# EAGLE design rc2014_romram (EAGLE 8.1.1)
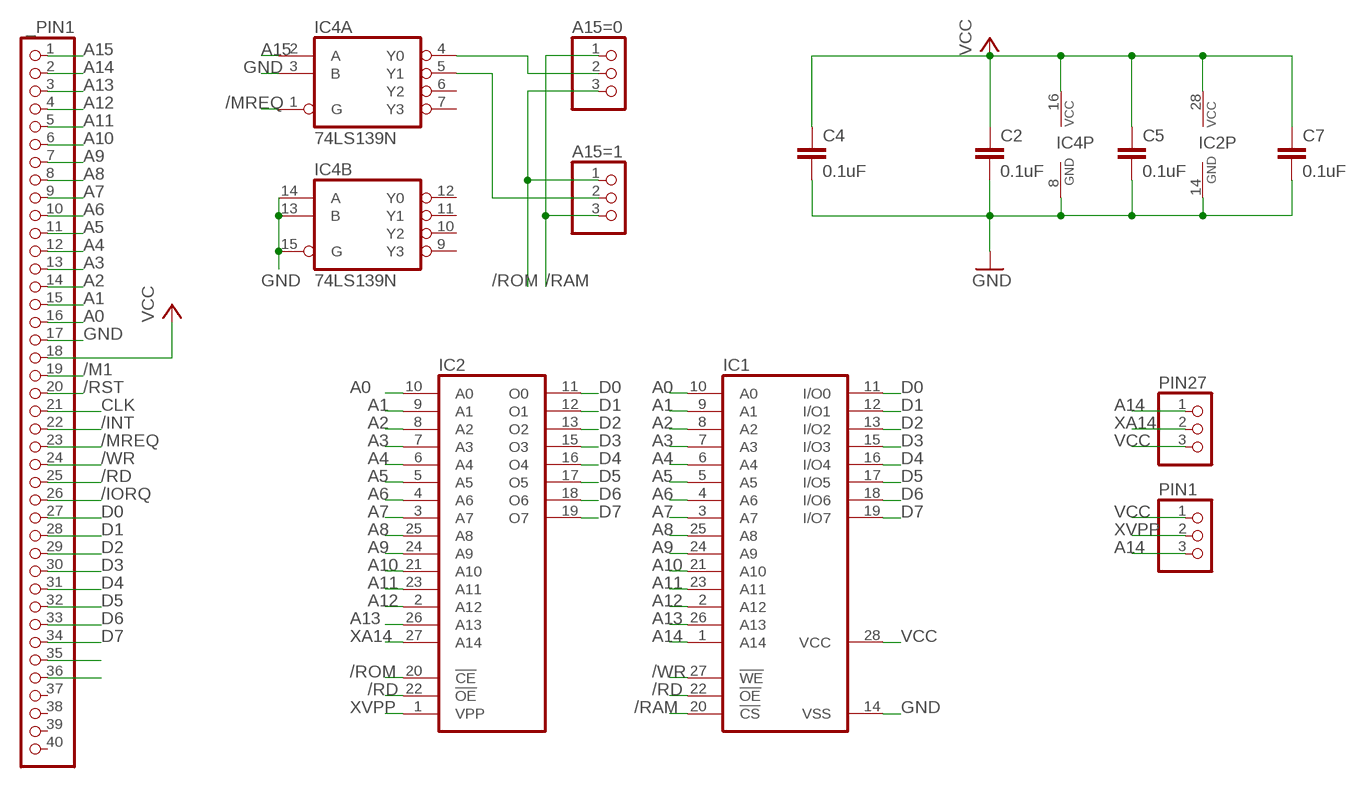
[diagram p0: schematic, sheet 1]

## Parts
_PIN1  PINHD-1X40  [1X40]
A15=0  PINHD-1X3  [1X03]
A15=1  PINHD-1X3  [1X03]
C2  0.1uF  C-EU050-024X044  [C050-024X044]
C4  0.1uF  C-EU050-024X044  [C050-024X044]
C5  0.1uF  C-EU050-024X044  [C050-024X044]
C7  0.1uF  C-EU050-024X044  [C050-024X044]
IC1  62256P  [DIL28-6]
IC2  27256  [DIL28]
IC4  74LS139N  [DIL16]
PIN1  PINHD-1X3  [1X03]
PIN27  PINHD-1X3  [1X03]

## Nets
/INT: _PIN1.22
/IORQ: _PIN1.26
/M1: _PIN1.19
/MREQ: _PIN1.23 IC4.1(A:G)
/RAM: A15=0.1 A15=1.3 IC1.20(!CS)
/RD: _PIN1.25 IC1.22(!OE) IC2.22(!OE)
/ROM: A15=0.3 A15=1.1 IC2.20(!CE)
/RST: _PIN1.20
/WR: _PIN1.24 IC1.27(!WE)
A0: _PIN1.16 IC1.10(A0) IC2.10(A0)
A1: _PIN1.15 IC1.9(A1) IC2.9(A1)
A2: _PIN1.14 IC1.8(A2) IC2.8(A2)
A3: _PIN1.13 IC1.7(A3) IC2.7(A3)
A4: _PIN1.12 IC1.6(A4) IC2.6(A4)
A5: _PIN1.11 IC1.5(A5) IC2.5(A5)
A6: _PIN1.10 IC1.4(A6) IC2.4(A6)
A7: _PIN1.9 IC1.3(A7) IC2.3(A7)
A8: _PIN1.8 IC1.25(A8) IC2.25(A8)
A9: _PIN1.7 IC1.24(A9) IC2.24(A9)
A10: _PIN1.6 IC1.21(A10) IC2.21(A10)
A11: _PIN1.5 IC1.23(A11) IC2.23(A11)
A12: _PIN1.4 IC1.2(A12) IC2.2(A12)
A13: _PIN1.3 IC1.26(A13) IC2.26(A13)
A14: _PIN1.2 IC1.1(A14) PIN1.3 PIN27.1
A15: _PIN1.1 IC4.2(A:A)
CLK: _PIN1.21
D0: _PIN1.27 IC1.11(I/O0) IC2.11(O0)
D1: _PIN1.28 IC1.12(I/O1) IC2.12(O1)
D2: _PIN1.29 IC1.13(I/O2) IC2.13(O2)
D3: _PIN1.30 IC1.15(I/O3) IC2.15(O3)
D4: _PIN1.31 IC1.16(I/O4) IC2.16(O4)
D5: _PIN1.32 IC1.17(I/O5) IC2.17(O5)
D6: _PIN1.33 IC1.18(I/O6) IC2.18(O6)
D7: _PIN1.34 IC1.19(I/O7) IC2.19(O7)
GND: _PIN1.17 C2.2 C4.2 C5.2 C7.2 IC1.14(VSS) IC2.14(GND) IC4.3(A:B) IC4.8(P:GND) IC4.13(B:B) IC4.14(B:A) IC4.15(B:G)
N$1: _PIN1.35
N$3: A15=0.2 IC4.4(A:Y0)
N$4: _PIN1.36
N$18: A15=1.2 IC4.5(A:Y1)
VCC: _PIN1.18 C2.1 C4.1 C5.1 C7.1 IC1.28(VCC) IC2.28(VCC) IC4.16(P:VCC) PIN1.1 PIN27.3
XA14: IC2.27(A14) PIN27.2
XVPP: IC2.1(VPP) PIN1.2
Unconnected: _PIN1.37 _PIN1.38 _PIN1.39 _PIN1.40 IC4.6(A:Y2) IC4.7(A:Y3) IC4.9(B:Y3) IC4.10(B:Y2) IC4.11(B:Y1) IC4.12(B:Y0)

## Library data of the parts
_PIN1 = pinhead:PINHD-1X40: PIN HEADER
A15=0 A15=1 PIN1 PIN27 = pinhead:PINHD-1X3: PIN HEADER
C2 C4 C5 C7 = rcl:C-EU: CAPACITOR, European symbol
IC1 = memory-hitachi:62256P: MEMORY; OC_FARNELL: unknown; OC_NEWARK: unknown
IC2 = memory:27256: MEMORY
IC4 = 74xx-eu:74*139: Dual 2-line to 4-line DECODER/DEMULTIPLEXER

## Net classes
0 +5V: width 0.508 mm

## Board
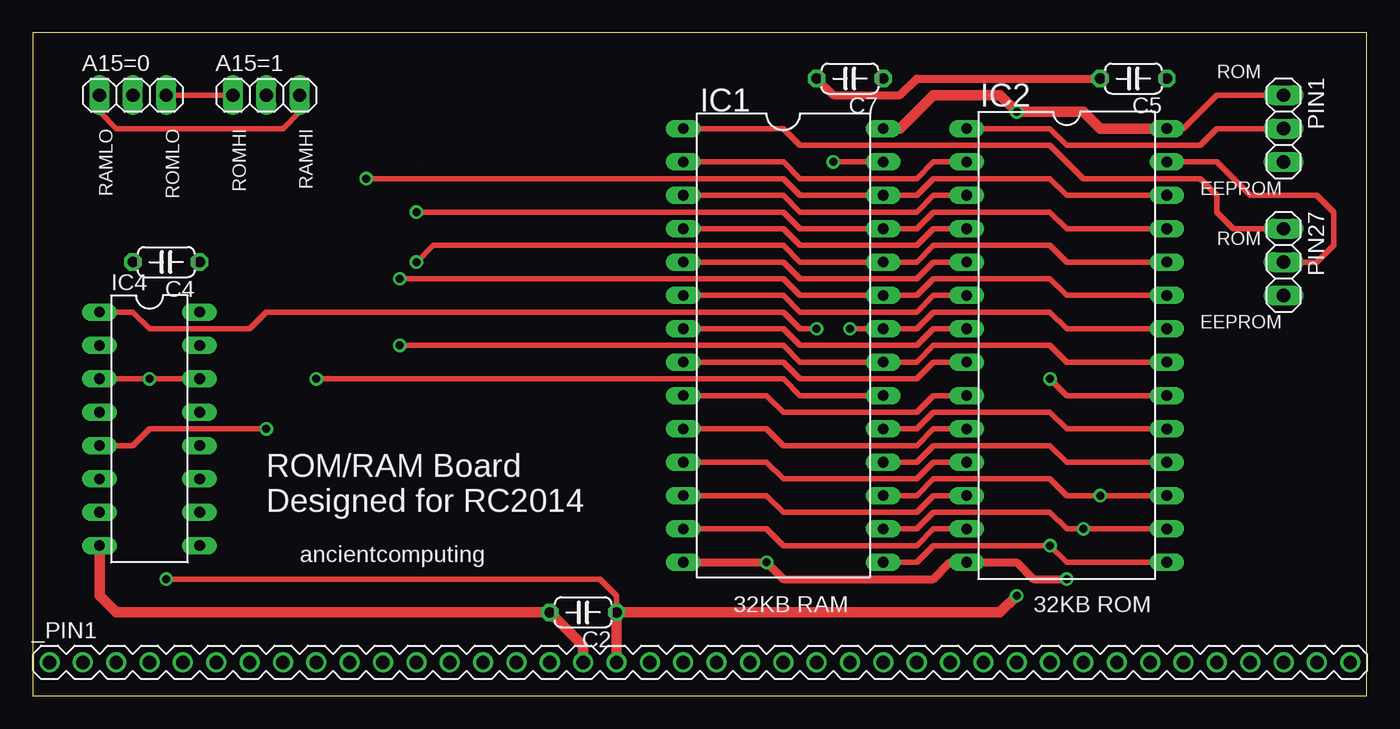
[diagram p1: board, top side]
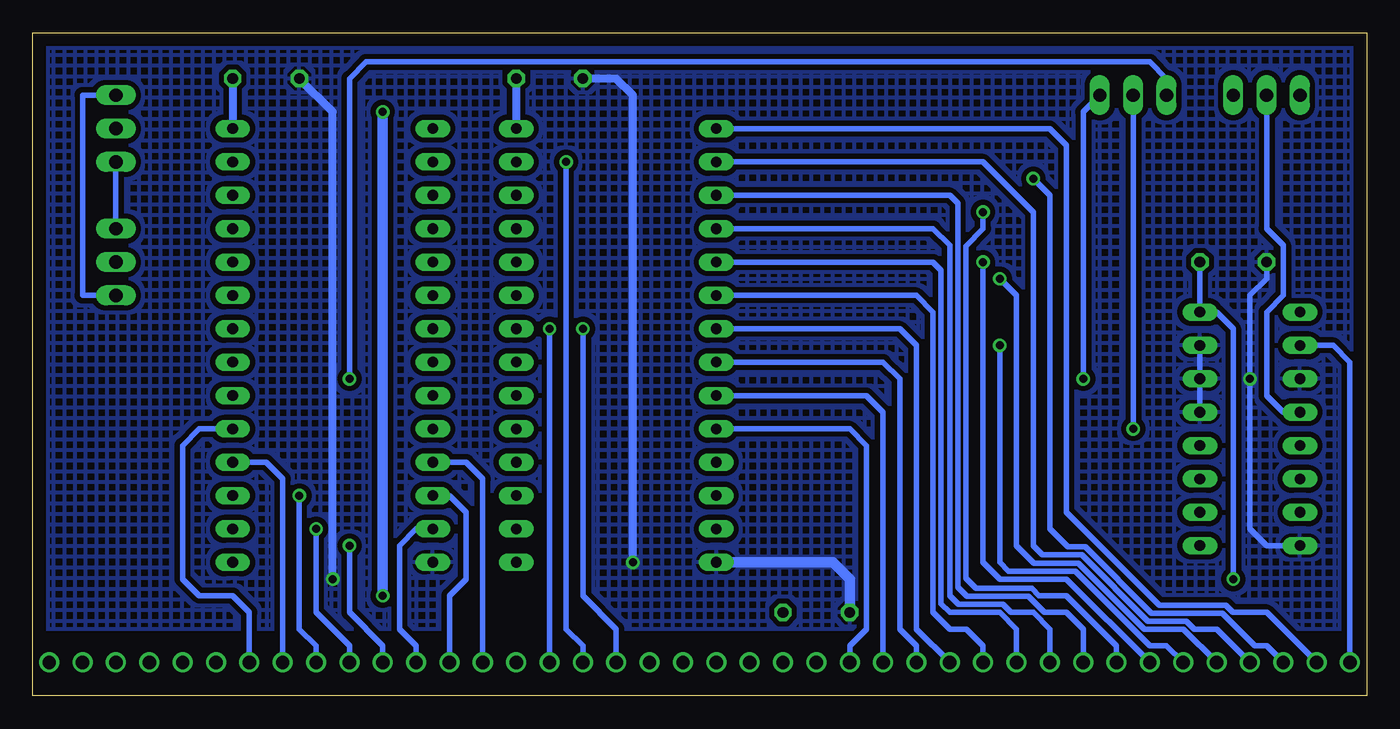
[diagram p2: board, bottom side, seen from below]

Size 101.58 x 50.47 mm. Coordinates in mm from the lower left corner, seen from the top.
Outline: 0,0 101.58,0 101.58,50.47 0,50.47 0,0
Copper layers (1*16): Top 0.035mm / dielectric 1.5mm / Bottom 0.035mm
Design rules "default": minimum track width 10mil, minimum drill 24mil, track to track 8mil, track to pad 8mil, pad to pad 8mil, via to via 8mil, smd to smd 8mil, copper to edge 40mil, drill to drill 8mil, minimum pad ring 10mil, minimum via ring 8mil, stop-mask expansion 4mil, vias tented up to drill 0mil, thermal gap 10mil

### Footprints (pad centres in the part's own frame; a part is rotated, then mirrored left to right if it is on the bottom)
1X40 = drill 1.016: 1 -49.53,0; 2 -46.99,0; 3 -44.45,0; 4 -41.91,0; 5 -39.37,0; 6 -36.83,0; 7 -34.29,0; 8 -31.75,0; 9 -29.21,0; 10 -26.67,0; 11 -24.13,0; 12 -21.59,0; 13 -19.05,0; 14 -16.51,0; 15 -13.97,0; 16 -11.43,0; 17 -8.89,0; 18 -6.35,0; 19 -3.81,0; 20 -1.27,0; 21 1.27,0; 22 3.81,0; 23 6.35,0; 24 8.89,0; 25 11.43,0; 26 13.97,0; 27 16.51,0; 28 19.05,0; 29 21.59,0; 30 24.13,0; 31 26.67,0; 32 29.21,0; 33 31.75,0; 34 34.29,0; 35 36.83,0; 36 39.37,0; 37 41.91,0; 38 44.45,0; 39 46.99,0; 40 49.53,0
1X03 = drill 1.016 long: 1 -2.54,0; 2 0,0; 3 2.54,0
C050-024X044 = drill 0.813 octagon: 1 -2.54,0; 2 2.54,0
DIL28-6 = drill 0.813 long: 1 -16.51,-7.62; 2 -13.97,-7.62; 3 -11.43,-7.62; 4 -8.89,-7.62; 5 -6.35,-7.62; 6 -3.81,-7.62; 7 -1.27,-7.62; 8 1.27,-7.62; 9 3.81,-7.62; 10 6.35,-7.62; 11 8.89,-7.62; 12 11.43,-7.62; 13 13.97,-7.62; 14 16.51,-7.62; 15 16.51,7.62; 16 13.97,7.62; 17 11.43,7.62; 18 8.89,7.62; 19 6.35,7.62; 20 3.81,7.62; 21 1.27,7.62; 22 -1.27,7.62; 23 -3.81,7.62; 24 -6.35,7.62; 25 -8.89,7.62; 26 -11.43,7.62; 27 -13.97,7.62; 28 -16.51,7.62
DIL28 = drill 0.813 long: 1 -16.51,-7.62; 2 -13.97,-7.62; 3 -11.43,-7.62; 4 -8.89,-7.62; 5 -6.35,-7.62; 6 -3.81,-7.62; 7 -1.27,-7.62; 8 1.27,-7.62; 9 3.81,-7.62; 10 6.35,-7.62; 11 8.89,-7.62; 12 11.43,-7.62; 13 13.97,-7.62; 14 16.51,-7.62; 15 16.51,7.62; 16 13.97,7.62; 17 11.43,7.62; 18 8.89,7.62; 19 6.35,7.62; 20 3.81,7.62; 21 1.27,7.62; 22 -1.27,7.62; 23 -3.81,7.62; 24 -6.35,7.62; 25 -8.89,7.62; 26 -11.43,7.62; 27 -13.97,7.62; 28 -16.51,7.62
DIL16 = drill 0.813 long: 1 -8.89,-3.81; 2 -6.35,-3.81; 3 -3.81,-3.81; 4 -1.27,-3.81; 5 1.27,-3.81; 6 3.81,-3.81; 7 6.35,-3.81; 8 8.89,-3.81; 9 8.89,3.81; 10 6.35,3.81; 11 3.81,3.81; 12 1.27,3.81; 13 -1.27,3.81; 14 -3.81,3.81; 15 -6.35,3.81; 16 -8.89,3.81

### Placement (x,y rotation side)
_PIN1  50.8,2.54 0 top
A15=0  7.62,45.72 0 top
A15=1  17.78,45.72 0 top
C2  41.91,6.35 180 top
C4  10.16,33.02 180 top
C5  83.82,46.99 180 top
C7  62.23,46.99 180 top
IC1  57.15,26.67 270 top
IC2  78.74,26.67 270 top
IC4  8.89,20.32 270 top
PIN1  95.25,43.18 270 top
PIN27  95.25,33.02 270 top

### Tracks (layer width: path | path; a pad name or v marks a point on that pad's centre or on a via)
/MREQ  (via drill 0.61)
  Top 0.406: IC4.1 7.62,29.21 8.89,27.94 16.51,27.94 17.78,29.21 57.15,29.21 58.42,27.94 v59.69,27.94
  Bottom 0.406: _PIN1.23 57.15,5.08 59.69,7.62 v59.69,27.94
/RAM  (via drill 0.61)
  Top 0.406: IC1.20 58.42,22.86 57.15,24.13 v21.59,24.13 | A15=0.1 5.08,44.45 6.35,43.18 19.05,43.18 20.32,44.45 A15=1.3
  Bottom 0.406: A15=1.3 21.59,44.45 v21.59,24.13
/RD  (via drill 0.61)
  Top 0.406: IC2.22 78.74,27.94 77.47,29.21 68.58,29.21 67.31,27.94 IC1.22 v62.23,27.94
  Bottom 0.406: v62.23,27.94 _PIN1.25
/ROM  (via drill 0.61)
  Top 0.406: A15=0.3 A15=1.1 | IC2.20 78.74,22.86 v77.47,24.13
  Bottom 0.406: v77.47,24.13 77.47,46.99 76.2,48.26 16.51,48.26 15.24,46.99 A15=1.1
/WR  (via drill 0.61)
  Top 0.406: IC1.27 v60.96,40.64
  Bottom 0.406: _PIN1.24 59.69,3.81 60.96,5.08 v60.96,40.64
A0
  Top 0.406: IC1.10 55.88,20.32 57.15,19.05 67.31,19.05 68.58,20.32 IC2.10
  Bottom 0.406: _PIN1.16 39.37,3.81 38.1,5.08 38.1,19.05 39.37,20.32 IC1.10
A1
  Top 0.406: IC1.9 55.88,22.86 57.15,21.59 67.31,21.59 68.58,22.86 IC2.9
  Bottom 0.406: _PIN1.15 36.83,21.59 38.1,22.86 IC1.9
A2
  Top 0.406: IC1.8 57.15,25.4 58.42,24.13 67.31,24.13 68.58,25.4 IC2.8
  Bottom 0.406: _PIN1.14 34.29,3.81 35.56,5.08 35.56,24.13 36.83,25.4 IC1.8
A3
  Top 0.406: IC1.7 57.15,27.94 58.42,26.67 67.31,26.67 68.58,27.94 IC2.7
  Bottom 0.406: _PIN1.13 34.29,5.08 34.29,26.67 35.56,27.94 IC1.7
A4
  Top 0.406: IC1.6 57.15,30.48 58.42,29.21 67.31,29.21 68.58,30.48 IC2.6
  Bottom 0.406: _PIN1.12 29.21,3.81 30.48,5.08 31.75,5.08 33.02,6.35 33.02,29.21 34.29,30.48 IC1.6
A5
  Top 0.406: IC1.5 57.15,33.02 58.42,31.75 67.31,31.75 68.58,33.02 IC2.5
  Bottom 0.406: _PIN1.11 26.67,5.08 27.94,6.35 31.75,6.35 32.41,7.01 32.41,32.41 33.02,33.02 IC1.5
A6
  Top 0.406: IC1.4 57.15,35.56 58.42,34.29 67.31,34.29 68.58,35.56 IC2.4
  Bottom 0.406: _PIN1.10 24.13,5.08 25.4,6.35 27.08,6.35 27.69,6.96 31.09,6.96 31.75,7.62 31.75,34.29 33.02,35.56 IC1.4
A7
  Top 0.406: IC1.3 57.15,38.1 58.42,36.83 67.31,36.83 68.58,38.1 IC2.3
  Bottom 0.406: _PIN1.9 21.59,5.08 22.86,6.35 24.54,6.35 25.76,7.57 30.43,7.57 31.14,8.28 31.14,37.49 31.75,38.1 IC1.3
A8  (via drill 0.61)
  Top 0.406: IC2.25 78.74,35.56 77.47,36.83 68.58,36.83 67.31,35.56 IC1.25 58.42,35.56 57.15,36.83 v29.21,36.83
  Bottom 0.406: _PIN1.8 19.05,3.81 22.86,7.62 24.95,7.62 25.5,8.18 29.77,8.18 30.53,8.94 30.53,34.24 29.21,35.56 v29.21,36.83
A9  (via drill 0.61)
  Top 0.406: IC2.24 78.74,33.02 77.47,34.29 68.58,34.29 67.31,33.02 IC1.24 58.42,33.02 57.15,34.29 30.48,34.29 v29.21,33.02
  Bottom 0.406: _PIN1.7 22.86,8.89 27.94,8.89 29.21,10.16 v29.21,33.02
A10  (via drill 0.61)
  Top 0.406: IC2.21 78.74,25.4 77.47,26.67 68.58,26.67 67.31,25.4 IC1.21 58.42,25.4 57.15,26.67 v27.94,26.67
  Bottom 0.406: v27.94,26.67 27.94,10.16 27.28,9.5 22.2,9.5 16.51,3.81 15.24,3.81 _PIN1.6
A11  (via drill 0.61)
  Top 0.406: IC2.23 78.74,30.48 77.47,31.75 68.58,31.75 67.31,30.48 IC1.23 58.42,30.48 57.15,31.75 v27.94,31.75
  Bottom 0.406: _PIN1.5 13.97,5.08 16.92,5.08 21.95,10.11 25.35,10.11 26.67,11.43 26.67,30.48 v27.94,31.75
A12  (1 unrouted)
  Top 0.406: IC1.2 57.15,40.64 58.42,39.37 67.31,39.37 68.58,40.64 IC2.2
  Bottom 0.406: _PIN1.4 11.43,5.08 13.11,5.08 13.72,5.69 16.66,5.69 21.7,10.72 24.69,10.72 25.4,11.43 25.4,36.83 29.21,40.64 IC1.2
A13  (via drill 0.61)
  Top 0.406: IC2.26 78.74,38.1 77.47,39.37 68.58,39.37 67.31,38.1 IC1.26 58.42,38.1 57.15,39.37 v25.4,39.37
  Bottom 0.406: _PIN1.3 7.62,3.81 8.51,3.81 11,6.3 16.41,6.3 21.44,11.33 22.76,11.33 24.13,12.7 24.13,38.1 v25.4,39.37
A14
  Top 0.406: IC1.1 57.15,43.18 58.42,41.91 77.47,41.91 80.01,39.37 88.9,39.37 90.17,38.1 90.17,36.83 91.44,35.56 PIN27.1
  Bottom 0.406: _PIN1.2 7.62,6.35 10.19,6.35 10.74,6.91 15.8,6.91 22.86,13.97 22.86,41.91 24.13,43.18 IC1.1 | PIN1.3 PIN27.1
A15
  Bottom 0.406: _PIN1.1 1.27,25.4 2.54,26.67 IC4.2
D0
  Top 0.406: IC1.11 55.88,17.78 57.15,16.51 67.31,16.51 68.58,17.78 IC2.11
  Bottom 0.406: _PIN1.27 67.31,16.51 68.58,17.78 IC2.11
D1
  Top 0.406: IC1.12 55.88,15.24 57.15,13.97 67.31,13.97 68.58,15.24 IC2.12
  Bottom 0.406: _PIN1.28 69.85,7.62 68.58,8.89 68.58,13.97 69.85,15.24 IC2.12
D2
  Top 0.406: IC1.13 55.88,12.7 57.15,11.43 67.31,11.43 68.58,12.7 IC2.13
  Bottom 0.406: _PIN1.29 72.39,3.81 73.66,5.08 73.66,11.43 72.39,12.7 IC2.13
D3  (via drill 0.61)
  Top 0.406: IC1.15 67.31,10.16 68.58,11.43 v77.47,11.43 78.74,10.16 IC2.15
  Bottom 0.406: _PIN1.30 74.93,3.81 77.47,6.35 v77.47,11.43
D4  (via drill 0.61)
  Top 0.406: IC1.16 67.31,12.7 68.58,13.97 77.47,13.97 78.74,12.7 v80.01,12.7 IC2.16
  Bottom 0.406: _PIN1.31 77.47,3.81 80.01,6.35 v80.01,12.7
D5  (via drill 0.61)
  Top 0.406: IC1.17 67.31,15.24 68.58,16.51 77.47,16.51 78.74,15.24 v81.28,15.24 IC2.17
  Bottom 0.406: _PIN1.32 80.01,3.81 81.28,5.08 v81.28,15.24
D6
  Top 0.406: IC1.18 67.31,17.78 68.58,19.05 77.47,19.05 78.74,17.78 IC2.18
  Bottom 0.406: _PIN1.33 82.55,16.51 83.82,17.78 IC2.18
D7
  Top 0.406: IC1.19 67.31,20.32 68.58,21.59 77.47,21.59 78.74,20.32 IC2.19
  Bottom 0.406: _PIN1.34 85.09,6.35 86.36,7.62 88.9,7.62 90.17,8.89 90.17,19.05 88.9,20.32 IC2.19
GND  (via drill 0.61)
  Top 0.406: IC4.3 v8.89,24.13 IC4.14
  Top 0.61: IC1.14 v55.88,10.16 57.15,8.89 68.58,8.89 69.85,10.16 IC2.14 74.93,10.16 76.2,8.89 v78.74,8.89 | C7.2 60.96,45.72 66.04,45.72 67.31,46.99 C5.2
  Top 0.813: _PIN1.17 41.91,3.81 C2.2 6.35,6.35 5.08,7.62 IC4.8
  Bottom 0.406: C4.2 7.62,31.75 8.89,30.48 v8.89,24.13 8.89,12.7 7.62,11.43 IC4.8 | IC4.15 IC4.14 IC4.13
  Bottom 0.61: v55.88,10.16 55.88,45.72 57.15,46.99 C7.2 | v78.74,8.89 78.74,44.45 C5.2
  Bottom 0.813: C2.2 39.37,8.89 40.64,10.16 IC1.14
  pour Bottom (isolate 0.406, hatched): 0,50.8 0,5.08 101.6,5.08 101.6,50.8
N$3
  Bottom 0.406: A15=0.2 7.62,35.56 6.35,34.29 6.35,30.48 7.62,29.21 7.62,22.86 6.35,21.59 IC4.4
N$18  (via drill 0.61)
  Top 0.406: IC4.5 7.62,19.05 8.89,20.32 v17.78,20.32
  Bottom 0.406: A15=1.2 v17.78,20.32
VCC  (via drill 0.61)
  Top 0.406: v10.16,8.89 43.18,8.89 44.45,7.62 C2.1 | IC2.28 87.63,43.18 90.17,45.72 PIN1.1
  Top 0.813: _PIN1.18 C2.1 73.66,6.35 v74.93,7.62 | IC1.28 66.04,43.18 68.58,45.72 73.66,45.72 v74.93,44.45 80.01,44.45 81.28,43.18 IC2.28
  Bottom 0.406: C4.1 IC4.16 11.43,29.21 10.16,27.94 v10.16,8.89 | PIN1.1 97.79,45.72 97.79,30.48 PIN27.3
  Bottom 0.61: C7.1 IC1.28 | C5.1 IC2.28
  Bottom 0.813: v74.93,44.45 v74.93,7.62
XA14
  Top 0.406: IC2.27 90.17,40.64 92.71,38.1 97.79,38.1 99.06,36.83 99.06,34.29 97.79,33.02 PIN27.2
XVPP
  Top 0.406: IC2.1 77.47,43.18 78.74,41.91 88.9,41.91 90.17,43.18 PIN1.2

### Text on the board
tNames: ROM | RAMLO | ROMLO | ROMHI | RAMHI | EEPROM | ROM | EEPROM | ROM/RAM Board / Designed for RC2014 | ancientcomputing | 32KB RAM | 32KB ROM